# Altium schematic sheet MCU089B_XDS110_MCU.SchDoc
size 431 x 279 mm; Date: Not shown in title block; ApprovedBy: Not shown in title block; CheckedBy: Not shown in title block; Author: Not shown in title block; CompanyName: Not shown in title block; Engineer: Not shown in title block; Organization: Not shown in title block; Address1: Not shown in title block; Address2: Not shown in title block; Address3: Not shown in title block; Address4: Not shown in title block; DocumentNumber: 7; Revision: Use project parameter SCH_Rev; SheetNumber: 7; SheetTotal: 8; PageSetup: Record=PageOptions|CenterHorizontal=True|CenterVertical=True|PrintScale=1.00|XCorrection=1.00|YCorrection=1.00|PrintKind=0|BorderSize=5000000|LeftOffset=0|BottomOffset=0|Orientation=2|PaperLength=1000|PaperWidth=1000|Scale=100|PaperSource=15|PrintQuality=600|MediaType=1|DitherType=10|PaperKind=Letter|PrintScaleMode=1; CurrentTime: Not shown in title block; CurrentDate: Not shown in title block; Time: Not shown in title block; DocumentFullPathAndName: Not shown in title block; DocumentName: Not shown in title block; ModifiedDate: Not shown in title block; ImagePath: Not shown in title block
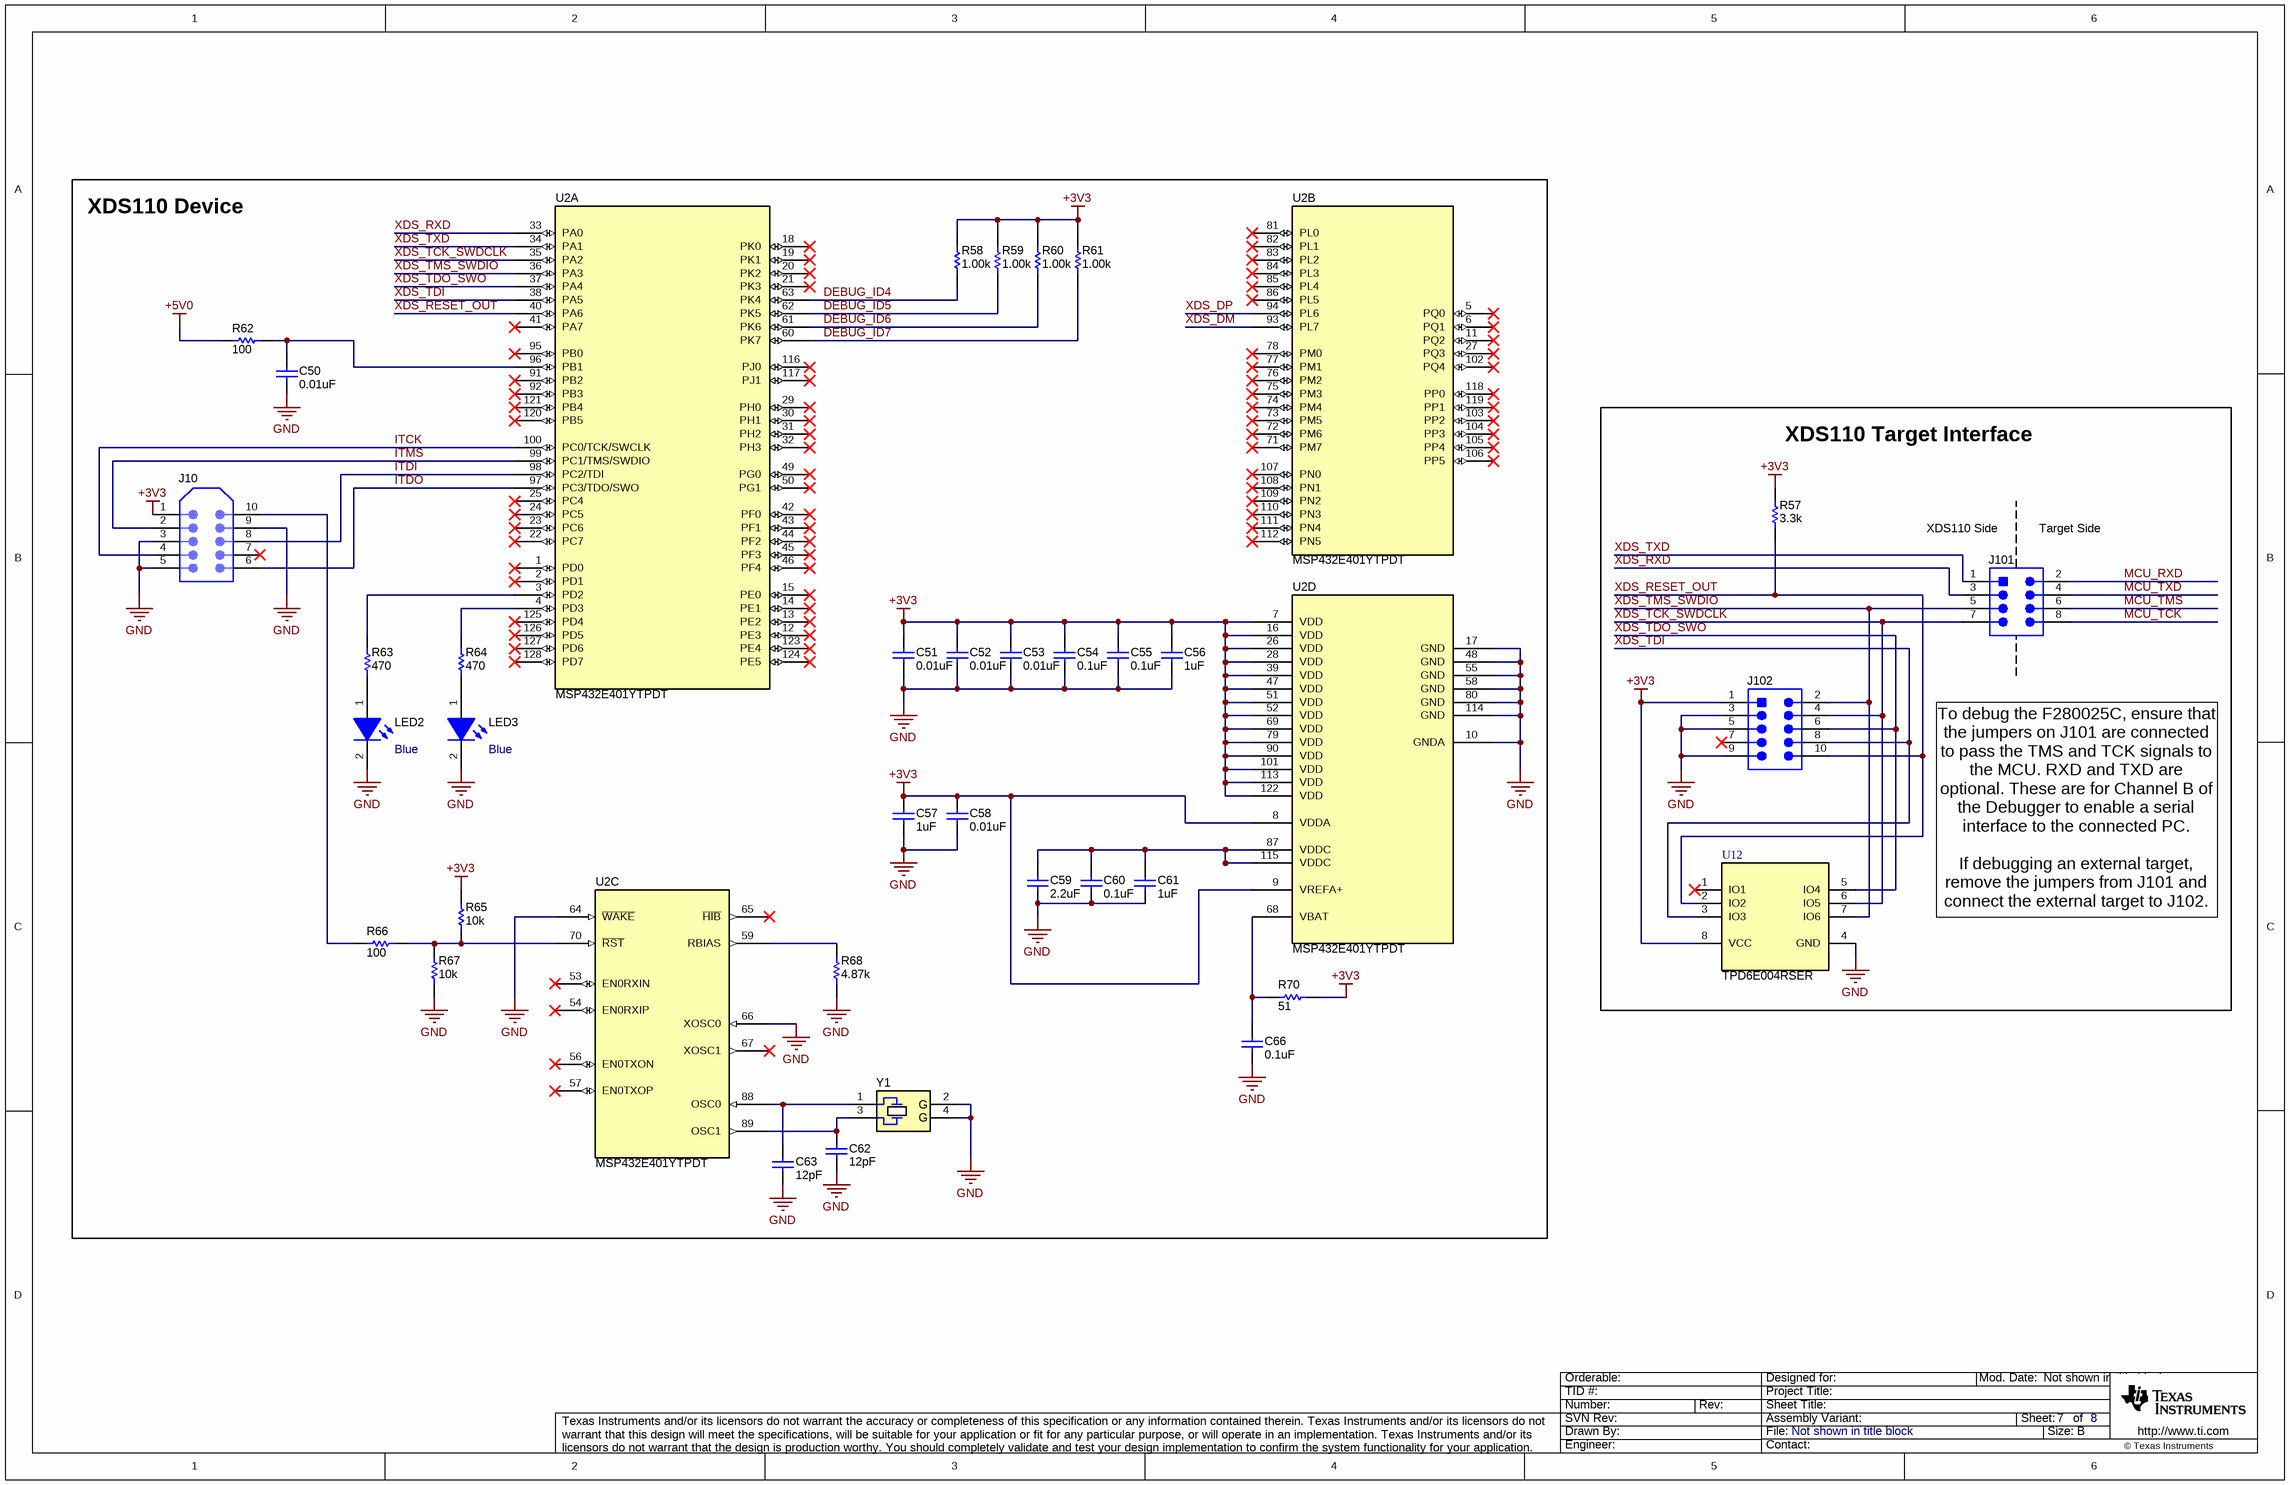
[diagram p0: MCU089B_XDS110_MCU.SchDoc]

## Parts
C50  ValueDisplayed: 0.01uF  [0402]  (hidden comment: GRM155R71E103KA01D)
C51  ValueDisplayed: 0.01uF  [0402]  (hidden comment: GRM155R71E103KA01D)
C52  ValueDisplayed: 0.01uF  [0402]  (hidden comment: GRM155R71E103KA01D)
C53  ValueDisplayed: 0.01uF  [0402]  (hidden comment: GRM155R71E103KA01D)
C54  ValueDisplayed: 0.1uF  [0402]  (hidden comment: GRM155R70J104KA01D)
C55  ValueDisplayed: 0.1uF  [0402]  (hidden comment: GRM155R70J104KA01D)
C56  ValueDisplayed: 1uF  [0402]  (hidden comment: 885012105012)
C57  ValueDisplayed: 1uF  [0402]  (hidden comment: 885012105012)
C58  ValueDisplayed: 0.01uF  [0402]  (hidden comment: GRM155R71E103KA01D)
C59  ValueDisplayed: 2.2uF  [0402]  (hidden comment: GRM155R60J225KE95D)
C60  ValueDisplayed: 0.1uF  [0402]  (hidden comment: GRM155R70J104KA01D)
C61  ValueDisplayed: 1uF  [0402]  (hidden comment: 885012105012)
C62  ValueDisplayed: 12pF  [0402]  (hidden comment: C0402C120J3GACAUTO)
C63  ValueDisplayed: 12pF  [0402]  (hidden comment: C0402C120J3GACAUTO)
C66  ValueDisplayed: 0.1uF  [0402]  (hidden comment: GRM155R70J104KA01D)
J10  TC2050-IDC-NL-FP  [Tag_TC2050-NL]  (value not drawn)  (no BOM)
J101  TSW-104-07-G-D  [TSW-104-07-G-D]  (value not drawn)
J102  FTSH-105-01-F-DV-K  [Samtec_FTSH-105-01-x-DV-K]  (value not drawn)
LED2  value Blue  [LTST-C170TBKT_Blue]  (hidden comment: LTST-C170TBKT)
LED3  value Blue  [LTST-C170TBKT_Blue]  (hidden comment: LTST-C170TBKT)
R57  ValueDisplayed: 3.3k  [0402]  (hidden comment: CRCW04023K30JNED)
R58  ValueDisplayed: 1.00k  [0402]  (hidden comment: CRCW04021K00FKED)
R59  ValueDisplayed: 1.00k  [0402]  (hidden comment: CRCW04021K00FKED)
R60  ValueDisplayed: 1.00k  [0402]  (hidden comment: CRCW04021K00FKED)
R61  ValueDisplayed: 1.00k  [0402]  (hidden comment: CRCW04021K00FKED)
R62  ValueDisplayed: 100  [0402]  (hidden comment: CRCW0402100RJNED)
R63  ValueDisplayed: 470  [0402]  (hidden comment: ERJ-2RKF4700X)
R64  ValueDisplayed: 470  [0402]  (hidden comment: ERJ-2RKF4700X)
R65  ValueDisplayed: 10k  [0402]  (hidden comment: CRCW040210K0JNED)
R66  ValueDisplayed: 100  [0402]  (hidden comment: CRCW0402100RJNED)
R67  ValueDisplayed: 10k  [0402]  (hidden comment: CRCW040210K0JNED)
R68  ValueDisplayed: 4.87k  [0402]  (hidden comment: CRCW04024K87FKED)
R70  ValueDisplayed: 51  [0402]  (hidden comment: CRCW040251R0JNED)
U2  MSP432E401YTPDT  [PDT0128A]  (parts A,B,C,D of 4)
U12  TPD6E004RSER  [RSE0008A]
Y1  NX3225GA-16.000M-STD-CRG-1  [NDK_NX3225GA]  (value not drawn)

## Blocks framed on the sheet
XDS110 Device: C50-C63 C66 J10 LED2 LED3 R58-R68 R70 U2 Y1
XDS110 Target Interface: J101 J102 R57 U12

## Nets
+3V3: C51.1 C52.1 C53.1 C54.1 C55.1 C56.1 C57.1 C58.1 J10.1 J102.1 R57.2 R58.2 R59.2 R60.2 R61.2 R65.2 R70.2 U2.7(VDD) U2.8(VDDA) U2.9(VREFA+) U2.16(VDD) U2.26(VDD) U2.28(VDD) U2.39(VDD) U2.47(VDD) U2.51(VDD) U2.52(VDD) U2.69(VDD) U2.79(VDD) U2.90(VDD) U2.101(VDD) U2.113(VDD) U2.122(VDD) U12.8(VCC)
+5V0: R62.1
GND: C50.2 C51.2 C52.2 C53.2 C54.2 C55.2 C56.2 C57.2 C58.2 C59.2 C60.2 C61.2 C62.2 C63.2 C66.2 J10.3 J10.5 J10.9 J102.3 J102.5 J102.9 LED2.2(K) LED3.2(K) R67.1 R68.1 U2.10(GNDA) U2.17(GND) U2.48(GND) U2.55(GND) U2.58(GND) U2.64(~{WAKE}) U2.66(XOSC0) U2.80(GND) U2.114(GND) U12.4(GND) Y1.2(GND) Y1.4(GND)
DEBUG_ID4: R58.1 U2.63(PK4)
DEBUG_ID5: R59.1 U2.62(PK5)
DEBUG_ID6: R60.1 U2.61(PK6)
DEBUG_ID7: R61.1 U2.60(PK7)
ITCK: J10.4 U2.100(PC0/TCK/SWCLK)
ITDI: J10.8 U2.98(PC2/TDI)
ITDO: J10.6 U2.97(PC3/TDO/SWO)
ITMS: J10.2 U2.99(PC1/TMS/SWDIO)
MCU_RXD: J101.2
MCU_TCK: J101.8
MCU_TMS: J101.6
MCU_TXD: J101.4
XDS_DM: U2.93(PL7)
XDS_DP: U2.94(PL6)
XDS_RESET_OUT: J102.10 R57.1 U2.40(PA6) U12.2(IO2)
XDS_RXD: J101.3 U2.33(PA0)
XDS_TCK_SWDCLK: J101.7 J102.4 U2.35(PA2) U12.6(IO5)
XDS_TDI: J102.8 U2.38(PA5) U12.3(IO3)
XDS_TDO_SWO: J102.6 U2.37(PA4) U12.5(IO4)
XDS_TMS_SWDIO: J101.5 J102.2 U2.36(PA3) U12.7(IO6)
XDS_TXD: J101.1 U2.34(PA1)
NetC50_1: C50.1 R62.2 U2.96(PB1)
NetC59_1: C59.1 C60.1 C61.1 U2.87(VDDC) U2.115(VDDC)
NetC62_1: C62.1 U2.89(OSC1) Y1.3
NetC63_1: C63.1 U2.88(OSC0) Y1.1
NetC66_1: C66.1 R70.1 U2.68(VBAT)
NetJ10_10: J10.10 R66.1
NetLED2_1: LED2.1(A) R63.1
NetLED3_1: LED3.1(A) R64.1
NetR63_2: R63.2 U2.3(PD2)
NetR64_2: R64.2 U2.4(PD3)
NetR65_1: R65.1 R66.2 R67.2 U2.70(~{RST})
NetR68_2: R68.2 U2.59(RBIAS)

Not connected (* = marked no-connect by the designer): J10 7*; J102 7*; U2 1(PD0)* 2(PD1)* 5(PQ0)* 6(PQ1)* 11(PQ2)* 12(PE3)* 13(PE2)* 14(PE1)* 15(PE0)* 18(PK0)* 19(PK1)* 20(PK2)* 21(PK3)* 22(PC7)* 23(PC6)* 24(PC5)* 25(PC4)* 27(PQ3)* 29(PH0)* 30(PH1)* 31(PH2)* 32(PH3)* 41(PA7)* 42(PF0)* 43(PF1)* 44(PF2)* 45(PF3)* 46(PF4)* 49(PG0)* 50(PG1)* 53(EN0RXIN)* 54(EN0RXIP)* 56(EN0TXON)* 57(EN0TXOP)* 65(~{HIB})* 67(XOSC1)* 71(PM7)* 72(PM6)* 73(PM5)* 74(PM4)* 75(PM3)* 76(PM2)* 77(PM1)* 78(PM0)* 81(PL0)* 82(PL1)* 83(PL2)* 84(PL3)* 85(PL4)* 86(PL5)* 91(PB2)* 92(PB3)* 95(PB0)* 102(PQ4)* 103(PP2)* 104(PP3)* 105(PP4)* 106(PP5)* 107(PN0)* 108(PN1)* 109(PN2)* 110(PN3)* 111(PN4)* 112(PN5)* 116(PJ0)* 117(PJ1)* 118(PP0)* 119(PP1)* 120(PB5)* 121(PB4)* 123(PE4)* 124(PE5)* 125(PD4)* 126(PD5)* 127(PD6)* 128(PD7)*; U12 1(IO1)*

## Notes on the sheet
- (near J101) XDS110 Side
- (near J101) Target Side
- To debug the F280025C, ensure that the jumpers on J101 are connected to pass the TMS and TCK signals to the MCU. RXD and TXD are optional. These are for Channel B of the Debugger to enable a serial interface to the connected PC.
  If debugging an external target, remove the jumpers from J101 and connect the external target to J102.
- Drawn By:
- SVN Rev:
- Number:
- TID #:
- Orderable:
- Rev:
- Sheet Title:
- File:
- Project Title:
- Designed for:
- Assembly Variant:
- Mod. Date:
- Sheet:
- Size:
- of
- B
- http://www.ti.com
- Texas Instruments and/or its licensors do not warrant the accuracy or completeness of this specification or any information contained therein. Texas Instruments and/or its licensors do not warrant that this design will meet the specifications, will be suitable for your application or fit for any particular purpose, or will operate in an implementation. Texas Instruments and/or its licensors do not warrant that the design is production worthy. You should completely validate and test your design implementation to confirm the system functionality for your application.
- Engineer:
- Contact:
- © Texas Instruments
- (in symbol CMP-0004635-3) G

## Library data of the parts
C50-C53 C58 = CMP-0006658-2: CAP, CERM, 0.01 uF, 25 V, +/- 10%, X7R, 0402; Manufacturer: MuRata; Polarized: N; Value: 0.01uF; U/M: EA; Cap_F: 10nF; Value1: Unknown; VDC_V: 25V; TaMin_C: -55°C; TaMax_C: 125°C; SizeArea_mm2: 0.5; SizeAreaWB_mm2: 3; SizeX_mm: 1; SizeZ_mm: 0.6; AEC Category: Q200; CompType: Capacitor; PartNumber: GRM155R71E103KA01D; PackageReference: 0402; RoHS: Y; Tolerance_%: 10%; Value2: 25V; MountType: SMT; Technology: Ceramic; TempCo: X7R; Cap_Case: 0402; SizeY_mm: 0.5; Published: 2008-06-19; Publisher: Texas Instruments; LatestRevisionDate: 2017-03-09; ComponentLink1Description: Datasheet link; ComponentLink1URL: http://search.murata.co.jp/Ceramy/PnsearchViewAction.do?HnOFG=ON&HnNFG=ON&SEL_CNT=50&sLang=en&sKey=GRM155R71E103KA01D&x=9&y=9&search=startwith; Supplier 1: Digi-Key; Supplier Part Number 1: 490-1312-1-ND; Supplier 2: Mouser; Supplier Part Number 2: 81-GRM36X103K25; Supplier 3: Farnell; Supplier Part Number 3: 8819734; AEC Qualified: ?
C54 C55 C60 C66 = CMP-0006623-2: CAP, CERM, 0.1 uF, 6.3 V, +/- 10%, X7R, 0402; Manufacturer: MuRata; Polarized: N; Value: 0.1uF; U/M: EA; Cap_F: 100nF; Value1: Unknown; VDC_V: 6.3V; TaMin_C: -55°C; TaMax_C: 125°C; SizeArea_mm2: 0.5; SizeAreaWB_mm2: 3; SizeX_mm: 1; SizeZ_mm: 0.6; AEC Category: Q200; CompType: Capacitor; PartNumber: GRM155R70J104KA01D; PackageReference: 0402; RoHS: Y; Tolerance_%: 10%; Value2: 6.3V; MountType: SMT; Technology: Ceramic; TempCo: X7R; Cap_Case: 0402; SizeY_mm: 0.5; Published: 2008-06-19; Publisher: Texas Instruments; LatestRevisionDate: 2017-03-09; ComponentLink1Description: Datasheet link; ComponentLink1URL: http://search.murata.co.jp/Ceramy/PnsearchViewAction.do?HnOFG=ON&HnNFG=ON&SEL_CNT=50&sLang=en&sKey=GRM155R70J104KA01D&x=9&y=9&search=startwith; Supplier 1: Digi-Key; Supplier Part Number 1: GRM155R70J104KA01D-ND; Supplier 2: Mouser; Supplier Part Number 2: 81-GRM155R70J104KA1D; AEC Qualified: ?
C56 C57 C61 = CMP-0064924-2: CAP, CERM, 1 uF, 10 V,+/- 20%, X5R, 0402; Manufacturer: Wurth Elektronik; Polarized: N; Value: 1uF; U/M: EA; Cap_F: 1µF; Value1: Unknown; VDC_V: 10V; TaMin_C: -55°C; TaMax_C: 85°C; SizeArea_mm2: 0.5; SizeAreaWB_mm2: 3; SizeX_mm: 1; SizeZ_mm: 0.6; AEC Category: Q200; CompType: Capacitor; PartNumber: 885012105012; PackageReference: 0402; RoHS: Y; Tolerance_%: 20%; Value2: 10V; MountType: SMT; Technology: Ceramic; TempCo: X5R; Cap_Case: 0402; SizeY_mm: 0.5; Published: 2008-06-19; Publisher: Texas Instruments; LatestRevisionDate: 2017-06-05; ComponentLink1Description: Datasheet link; ComponentLink1URL: http://katalog.we-online.de/pbs/datasheet/885012105012.pdf; Supplier 1: Digi-Key; Supplier Part Number 1: 732-7489-1-ND; Supplier 2: Newark; Supplier Part Number 2: 75Y5997; Supplier 3: Mouser; Supplier Part Number 3: 710-885012105012; AEC Qualified: N; AEC Grade: N/A
C59 = CMP-0006543-2: CAP, CERM, 2.2 uF, 6.3 V, +/- 10%, X5R, 0402; Manufacturer: MuRata; Polarized: N; Value: 2.2uF; U/M: EA; Cap_F: 2.2µF; Value1: Unknown; VDC_V: 6.3V; TaMin_C: -55°C; TaMax_C: 85°C; SizeArea_mm2: 0.5; SizeAreaWB_mm2: 3; SizeX_mm: 1; SizeZ_mm: 0.6; AEC Category: Q200; CompType: Capacitor; PartNumber: GRM155R60J225KE95D; PackageReference: 0402; RoHS: Y; Tolerance_%: 10%; Value2: 6.3V; MountType: SMT; Technology: Ceramic; TempCo: X5R; Cap_Case: 0402; SizeY_mm: 0.5; Published: 2008-06-19; Publisher: Texas Instruments; LatestRevisionDate: 2017-03-09; ComponentLink1Description: Datasheet link; ComponentLink1URL: http://psearch.en.murata.com/capacitor/product/GRM155R60J225KE95%23.pdf; Supplier 1: Mouser; Supplier Part Number 1: 81-GRM155R60J225KE5D; AEC Qualified: N; AEC Grade: N/A
C62 C63 = CMP-0006239-2: CAP, CERM, 12 pF, 25 V, +/- 5%, C0G/NP0, AEC-Q200 Grade 1, 0402; Manufacturer: Kemet; TaMin_C: -55°C; Polarized: N; SizeAreaWB_mm2: 3; Value1: Unknown; U/M: EA; Value: 12pF; TaMax_C: 125°C; SizeZ_mm: 0.6; SizeX_mm: 1; SizeY_mm: 0.5; Value2: 25V; AEC Qualified: Y; AEC Category: Q200; Supplier Part Number 2: 86T2558; Publisher: Texas Instruments; Supplier 2: Newark; Supplier Part Number 3: 80-C0402C120J3GAUTO; TempCo: C0G/NP0; Supplier 3: Mouser; Published: 2008-06-19; RoHS: Y; MountType: SMT; Supplier 1: Digi-Key; PackageReference: 0402; Tolerance_%: 5%; Cap_Case: 0402; SizeArea_mm2: 0.5; CompType: Capacitor; LatestRevisionDate: 2017-03-09; PartNumber: C0402C120J3GACAUTO; Cap_F: 12pF; VDC_V: 25V; ComponentLink1Description: Datasheet link; AEC Grade: 1; Supplier Part Number 1: 399-6829-1-ND; Technology: Ceramic; ComponentLink1URL: http://www.kemet.com/Lists/ProductCatalog/Attachments/420/KEM_C1022_C0G_AUTO_SMD.pdf
J10 = CMP-0075101-1: Footprint for Tag-Connect TC2050 No-Legs cables; CompType: Receptacle; Note: Footprint only, to mate with Tag-Connect TC2050 No-Legs cables; CNHeader: False; PartNumber: TC2050-IDC-NL-FP; Manufacturer: Tag-Connect; PackageReference: Footprint for TC2050 No Legs series of cables; MountType: N/A; ComponentLink1Description: Datasheet URL; ComponentLink1URL: http://www.tag-connect.com/Materials/TC2050-IDC-430-NL%20Datasheet.pdf; Publisher: Texas Instruments; LatestRevisionDate: 2017-07-12; CT: False
J101 = CMP-0075408-2: Header, 100mil, 4x2, Gold, TH; Manufacturer: Samtec; Pitch_mm: 2.54; Cert_VDE: N; Gender: Male; Cert_CSA: Y; Voltage_V: 550V; Green_REACh: Passed; Current_A: 6.3A; Green_Lifecycle: Active; Row_Count: 2; ComponentLink1Description: Datasheet URL; RoHS: Y; Supplier 1: Digi-Key; Cert_UL: Y; Orientation: Vertical; Green_EU RoHS: Passed; PackageReference: 4x2 Header; Color: Black; PartNumber: TSW-104-07-G-D; PinCount: 8; ContactFinish: Gold; Cert_CULUS: N; Shrouded: N; ClassName: Header; RowSpacing_mm: 2.54; ComponentLink1URL: http://samtec.com/ftppub/pdf/TSW_TH.PDF; CompType: Header; MountType: TH; Supplier Part Number 1: SAM1028-04-ND; Green_EU RoHS-2: Passed
J102 = CMP-0075670-2: Header (Shrouded), 1.27mm, 5x2, Gold, SMT; Manufacturer: Samtec; Pitch_mm: 1.27; Gender: Male; Shrouded: Y; Row_Count: 2; Current_A: 3.3A; PartNumber: FTSH-105-01-F-DV-K; PackageReference: Header(Shrouded), 1.27mm, 5x2, SMT; CompType: Header; RoHS: Y; MountType: SMT; ComponentLink1Description: Datasheet URL; ComponentLink1URL: http://suddendocs.samtec.com/prints/ftsh-1xx-xx-xxx-dv-xxx-mkt.pdf; Orientation: Vertical; PinCount: 10; RowSpacing_mm: 1.27; ContactFinish: Gold; Color: Black; Cert_CSA: Y; Cert_UL: Y; Supplier 1: Digi-Key; Supplier Part Number 1: SAM8796-ND; Supplier 2: Newark; Supplier Part Number 2: 45P5160
LED2 LED3 = CMP-0002889-2: LED, Blue, SMD; Manufacturer: Lite-On; Type: AlInGaP; Vf_V: 3.3V; Io_A: 20mA; Value1: W; PartNumber: LTST-C170TBKT; PackageReference: LED_0805; RoHS: Y; CompType: LED; MountType: SMT; Value2: 3.3V; Color: Blue; ComponentLink1URL: http://optoelectronics.liteon.com/upload/download/DS-22-99-0226/S_110_LTST-C170TBKT.pdf; ComponentLink1Description: Datasheet link
R57 = CMP-0026918-5: RES, 3.3 k, 5%, 0.063 W, AEC-Q200 Grade 0, 0402; Manufacturer: Vishay-Dale; Value: 3.3k; Value_Code: 3k30; Power_W: 63mW; Value2: 0.063W; VDC_V: 50V; TempCo: 200 ppm/C; SizeArea_mm2: 0.5; SizeX_mm: 1; SizeZ_mm: 0.6; EIA_Code: E24; AEC Category: Q200; AEC Qualified: Y; AEC Grade: 0; CompType: Resistor; PartNumber: CRCW04023K30JNED; PackageReference: 0402; RoHS: E; Res_ohm: 3.3k; Tolerance_%: 5%; Value1: 5%; MountType: SMT; Technology: Thick Film; SizeY_mm: 0.5; ComponentLink1Description: Datasheet link; ComponentLink1URL: http://www.vishay.com/docs/20035/dcrcwe3.pdf; Supplier 1: Digi-Key; Supplier Part Number 1: 541-3.3KJCT-ND; Supplier 2: Newark; Supplier Part Number 2: 59M6723; Supplier 3: Mouser; Supplier Part Number 3: 71-CRCW0402J-3.3K-E3
R58-R61 = CMP-0026071-3: RES, 1.00 k, 1%, 0.063 W, AEC-Q200 Grade 0, 0402; Manufacturer: Vishay-Dale; Power_W: 63mW; TempCo: 100 ppm/C; Value_Code: 1k00; Value: 1.00k; EIA_Code: E96; Res_ohm: 1k; SizeX_mm: 1; SizeY_mm: 0.5; SizeZ_mm: 0.6; Value2: 0.063W; AEC Qualified: Y; VDC_V: 50V; AEC Category: Q200; AEC Grade: 0; Supplier Part Number 2: 52K6545; Supplier 2: Newark; Supplier Part Number 3: 71-CRCW0402-1.0K-E3; Supplier 3: Mouser; RoHS: E; Value1: 1%; MountType: SMT; Supplier 1: Digi-Key; PackageReference: 0402; Tolerance_%: 1%; SizeArea_mm2: 0.5; CompType: Resistor; PartNumber: CRCW04021K00FKED; ComponentLink1Description: Datasheet link; Supplier Part Number 1: 541-1.00KLCT-ND; Technology: Thick Film; ComponentLink1URL: http://www.vishay.com/docs/20035/dcrcwe3.pdf
R62 R66 = CMP-0026824-3: RES, 100, 5%, 0.063 W, AEC-Q200 Grade 0, 0402; Manufacturer: Vishay-Dale; Value: 100; Value_Code: 100R; Power_W: 63mW; Value2: 0.063W; VDC_V: 50V; TempCo: 200 ppm/C; SizeArea_mm2: 0.5; SizeX_mm: 1; SizeZ_mm: 0.6; EIA_Code: E24; AEC Category: Q200; AEC Qualified: Y; AEC Grade: 0; CompType: Resistor; PartNumber: CRCW0402100RJNED; PackageReference: 0402; RoHS: E; Res_ohm: 100; Tolerance_%: 5%; Value1: 5%; MountType: SMT; Technology: Thick Film; SizeY_mm: 0.5; ComponentLink1Description: Datasheet link; ComponentLink1URL: http://www.vishay.com/docs/20035/dcrcwe3.pdf; Supplier 1: Digi-Key; Supplier Part Number 1: 541-100JCT-ND; Supplier 2: Newark; Supplier Part Number 2: 59M6700; Supplier 3: Mouser; Supplier Part Number 3: 71-CRCW0402J-100-E3
R63 R64 = CMP-0026699-1: RES, 470, 1%, 0.1 W, AEC-Q200 Grade 0, 0402; Manufacturer: Panasonic; Value: 470; Value_Code: 470R; Power_W: 100mW; Value2: 0.1W; VDC_V: 50V; TempCo: 100 ppm/C; SizeArea_mm2: 0.5; SizeX_mm: 1; SizeZ_mm: 0.6; U/M: EA; AEC Category: Q200; AEC Qualified: Y; AEC Grade: 0; CompType: Resistor; PartNumber: ERJ-2RKF4700X; PackageReference: 0402; RoHS: Y; Res_ohm: 470; Tolerance_%: 1%; Value1: 1%; MountType: SMT; Technology: Thick Film; SizeY_mm: 0.5; Published: 2008-06-26; Publisher: Texas Instruments; LatestRevisionDate: 2017-03-09; ComponentLink1Description: Datasheet link; ComponentLink1URL: http://industrial.panasonic.com/lecs/www-data/pdf/AOA0000/AOA0000CE2.pdf; Supplier 1: Digi-Key; Supplier Part Number 1: P470LCT-ND; Supplier 2: Mouser; Supplier Part Number 2: 667-ERJ-2RKF4700X; Supplier 3: Farnell; Supplier Part Number 3: 2397145
R65 R67 = CMP-0026825-5: RES, 10 k, 5%, 0.063 W, AEC-Q200 Grade 0, 0402; Manufacturer: Vishay-Dale; Value: 10k; Value_Code: 10k0; Power_W: 63mW; Value2: 0.063W; VDC_V: 50V; TempCo: 200 ppm/C; SizeArea_mm2: 0.5; SizeX_mm: 1; SizeZ_mm: 0.6; EIA_Code: E24; AEC Category: Q200; AEC Qualified: Y; AEC Grade: 0; CompType: Resistor; PartNumber: CRCW040210K0JNED; PackageReference: 0402; RoHS: E; Res_ohm: 10k; Tolerance_%: 5%; Value1: 5%; MountType: SMT; Technology: Thick Film; SizeY_mm: 0.5; ComponentLink1Description: Datasheet link; ComponentLink1URL: http://www.vishay.com/docs/20035/dcrcwe3.pdf; Supplier 1: Digi-Key; Supplier Part Number 1: 541-10KJCT-ND; Supplier 2: Newark; Supplier Part Number 2: 59M6696; Supplier 3: Mouser; Supplier Part Number 3: 71-CRCW0402J-10K-E3
R68 = CMP-0026413-2: RES, 4.87 k, 1%, 0.063 W, AEC-Q200 Grade 0, 0402; Manufacturer: Vishay-Dale; Value: 4.87k; Value_Code: 4k87; Power_W: 63mW; Value2: 0.063W; VDC_V: 50V; TempCo: 100 ppm/C; SizeArea_mm2: 0.5; SizeX_mm: 1; SizeZ_mm: 0.6; EIA_Code: E96; AEC Category: Q200; AEC Qualified: Y; AEC Grade: 0; CompType: Resistor; PartNumber: CRCW04024K87FKED; PackageReference: 0402; RoHS: E; Res_ohm: 4.87k; Tolerance_%: 1%; Value1: 1%; MountType: SMT; Technology: Thick Film; SizeY_mm: 0.5; ComponentLink1Description: Datasheet link; ComponentLink1URL: http://www.vishay.com/docs/20035/dcrcwe3.pdf; Supplier 1: Digi-Key; Supplier Part Number 1: 541-4.87KLCT-ND; Supplier 2: Newark; Supplier Part Number 2: 52K7047; Supplier 3: Mouser; Supplier Part Number 3: 71-CRCW0402-4.87K-E3
R70 = CMP-0026946-3: RES, 51, 5%, 0.063 W, AEC-Q200 Grade 0, 0402; Manufacturer: Vishay-Dale; Value: 51; Value_Code: 51R0; Power_W: 63mW; Value2: 0.063W; VDC_V: 50V; TempCo: 200 ppm/C; SizeArea_mm2: 0.5; SizeX_mm: 1; SizeZ_mm: 0.6; EIA_Code: E24; AEC Category: Q200; AEC Qualified: Y; AEC Grade: 0; CompType: Resistor; PartNumber: CRCW040251R0JNED; PackageReference: 0402; RoHS: E; Res_ohm: 51; Tolerance_%: 5%; Value1: 5%; MountType: SMT; Technology: Thick Film; SizeY_mm: 0.5; ComponentLink1Description: Datasheet link; ComponentLink1URL: http://www.vishay.com/docs/20035/dcrcwe3.pdf; Supplier 1: Digi-Key; Supplier Part Number 1: 541-51JCT-ND; Supplier 2: Newark; Supplier Part Number 2: 72M6804; Supplier 3: Mouser; Supplier Part Number 3: 71-CRCW0402J-51-E3
U2 = CMP-0077953-1: MSP432E401YTPDT, PDT0128A (TQFP-128); Alternate PartNumber: MSP432E401YTPDTR; Alternate Manufacturer: Texas Instruments; SizeAreaWB_mm2: 324; SizeZ_mm: 1.2; SizeX_mm: 16; SizeArea_mm2: 256; CompType: IC; AEC Qualified: N; AEC Category: Q200; ComponentLink1URL: http://www.ti.com/lit/ds/symlink/tm4c129encpdt.pdf; PackageDescription: TQFP-128; MountType: SMT; ComponentLink2URL: TBD; ComponentLink2Description: Product Folder; Manufacturer: Texas Instruments; PackageReference: PDT0128A; SizeY_mm: 16; PartNumber: MSP432E401YTPDT; ComponentLink1Description: Datasheet Link; PartId: 1
U12 = CMP-0043125-4: Low-Capacitance 6-Channel +/-15 kV ESD Protection Array for High-Speed Data Interfaces, RSE0008A (UQFN-8); Manufacturer: Texas Instruments; 1394 / Firewire: TRUE; Breakdown Voltage(Min)(V): 6; Eco-Plan: Green (RoHS & no Sb/Br); IEC 61000-4-2 Air-Gap(+/- kV): 12; IEC 61000-4-2 Contact(+/- kV): 8; IO Capacitance(Typ)(pF): 1.6; IO Leakage Current(nA): 1; SubFamily: ESD Solution; AEC Category: Q200; AEC Qualified: N; CompType: IC; SizeAreaWB_mm2: 6.25; SizeArea_mm2: 2.25; SizeX_mm: 1.5; SizeZ_mm: 0.6; DatasheetVersion: SLLS799A; PackageVersion: revD, Jan-2011; PackageReference: RSE0008A; PackageDescription: UQFN-8; Serial ATA / eSATA: TRUE; USB High Speed: TRUE; PartNumber: TPD6E004RSER; ComponentLink1Description: Datasheet Link; ComponentLink1URL: http://www.ti.com/lit/ds/symlink/tpd6e004.pdf; ComponentLink2Description: Product Folder; ComponentLink2URL: http://www.ti.com/product/tpd6e004; ComponentLink3Description: Online Datasheet; ComponentLink3URL: http://www.ti.com/product/tpd6e004/datasheet; MountType: SMT; RoHS: Y; SizeY_mm: 1.5
Y1 = CMP-0004635-3: Crystal, 16 MHz, 8pF, SMD; Manufacturer: NDK; TaMin_C: -10°C; TaMax_C: 70°C; Frequency Stability: +/-30ppm; Frequency_Fixed: 16MHz; PartNumber: NX3225GA-16.000M-STD-CRG-1; CompType: Crystal; PackageReference: 3.2x0.75x2.5mm; MountType: SMT; RoHS: Y; ComponentLink1Description: Datasheet Link; ComponentLink1URL: http://www.ndk.com/images/products/catalog/c_NX3225GA-STD-CRG-1_e.pdf; Supplier 1: Digi-Key; Supplier Part Number 1: 644-1157-1-ND